# Altium schematic sheet Horn.SchDoc
size A4; PageSetup: Record=PageOptions|CenterHorizontal=False|CenterVertical=True|PrintScale=1.46|XCorrection=1.00|YCorrection=1.00|PrintKind=2|BorderSize=5000000|LeftOffset=0|BottomOffset=0|Orientation=2|PaperLength=1000|PaperWidth=1000|Scale=100|PaperSource=7|PrintQuality=-4|MediaType=1|DitherType=10|PaperKind=A4 (210 x 297 ìì)|PrintScaleMode=1
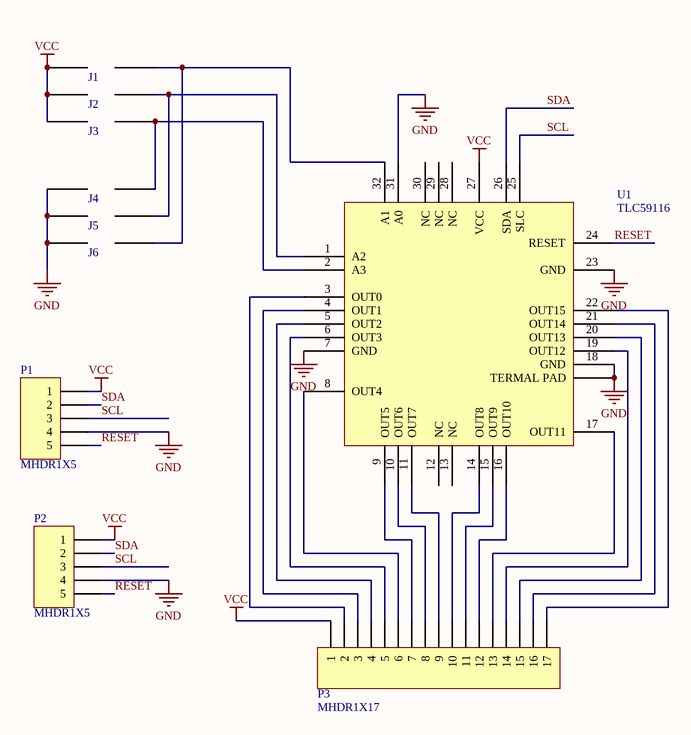
[diagram p0: Horn.SchDoc]

## Parts
J1  Jamper  [Jumper]  (value not drawn)
J2  Jamper  [Jumper]  (value not drawn)
J3  Jamper  [Jumper]  (value not drawn)
J4  Jamper  [Jumper]  (value not drawn)
J5  Jamper  [Jumper]  (value not drawn)
J6  Jamper  [Jumper]  (value not drawn)
P1  MHDR1X5  [MHDR1X5]
P2  MHDR1X5  [MHDR1X5]
P3  MHDR1X17  [MHDR1X17]
U1  TLC59116  [QFN50P500X500X100-32N]

## Nets
GND: J4.2 J5.2 J6.2 P1.4 P2.4 U1.7(GND) U1.18(GND) U1.23(GND) U1.31(A0) U1.33(TERMAL_PAD)
VCC: J1.2 J2.2 J3.2 P1.1 P2.1 P3.1 U1.27(VCC)
RESET: P1.5 P2.5 U1.24(RESET)
SCL: P1.3 P2.3 U1.25(SLC)
SDA: P1.2 P2.2 U1.26(SDA)
NetJ1_1: J1.1 J6.1 U1.32(A1)
NetJ2_1: J2.1 J5.1 U1.1(A2)
NetJ3_1: J3.1 J4.1 U1.2(A3)
NetP3_2: P3.2 U1.3(OUT0)
NetP3_3: P3.3 U1.4(OUT1)
NetP3_4: P3.4 U1.5(OUT2)
NetP3_5: P3.5 U1.6(OUT3)
NetP3_6: P3.6 U1.8(OUT4)
NetP3_7: P3.7 U1.9(OUT5)
NetP3_8: P3.8 U1.10(OUT6)
NetP3_9: P3.9 U1.11(OUT7)
NetP3_10: P3.10 U1.14(OUT8)
NetP3_11: P3.11 U1.15(OUT9)
NetP3_12: P3.12 U1.16(OUT10)
NetP3_13: P3.13 U1.17(OUT11)
NetP3_14: P3.14 U1.19(OUT12)
NetP3_15: P3.15 U1.20(OUT13)
NetP3_16: P3.16 U1.21(OUT14)
NetP3_17: P3.17 U1.22(OUT15)

Not connected (* = marked no-connect by the designer): U1 12(NC) 13(NC) 28(NC) 29(NC) 30(NC)

## Library data of the parts
P1 P2 = MHDR1X5: Header, 5-Pin; LatestRevisionDate: 17-Jul-2002; LatestRevisionNote: Re-released for DXP Platform.; Publisher: Altium Limited
P3 = MHDR1X17: Header, 17-Pin; LatestRevisionDate: 17-Jul-2002; LatestRevisionNote: Re-released for DXP Platform.; Publisher: Altium Limited
U1 = TLC59116FIRHBR